# Altium schematic sheet Other Components.SchDoc: Other Components
size A3; SheetNumber: 1; SheetTotal: 1
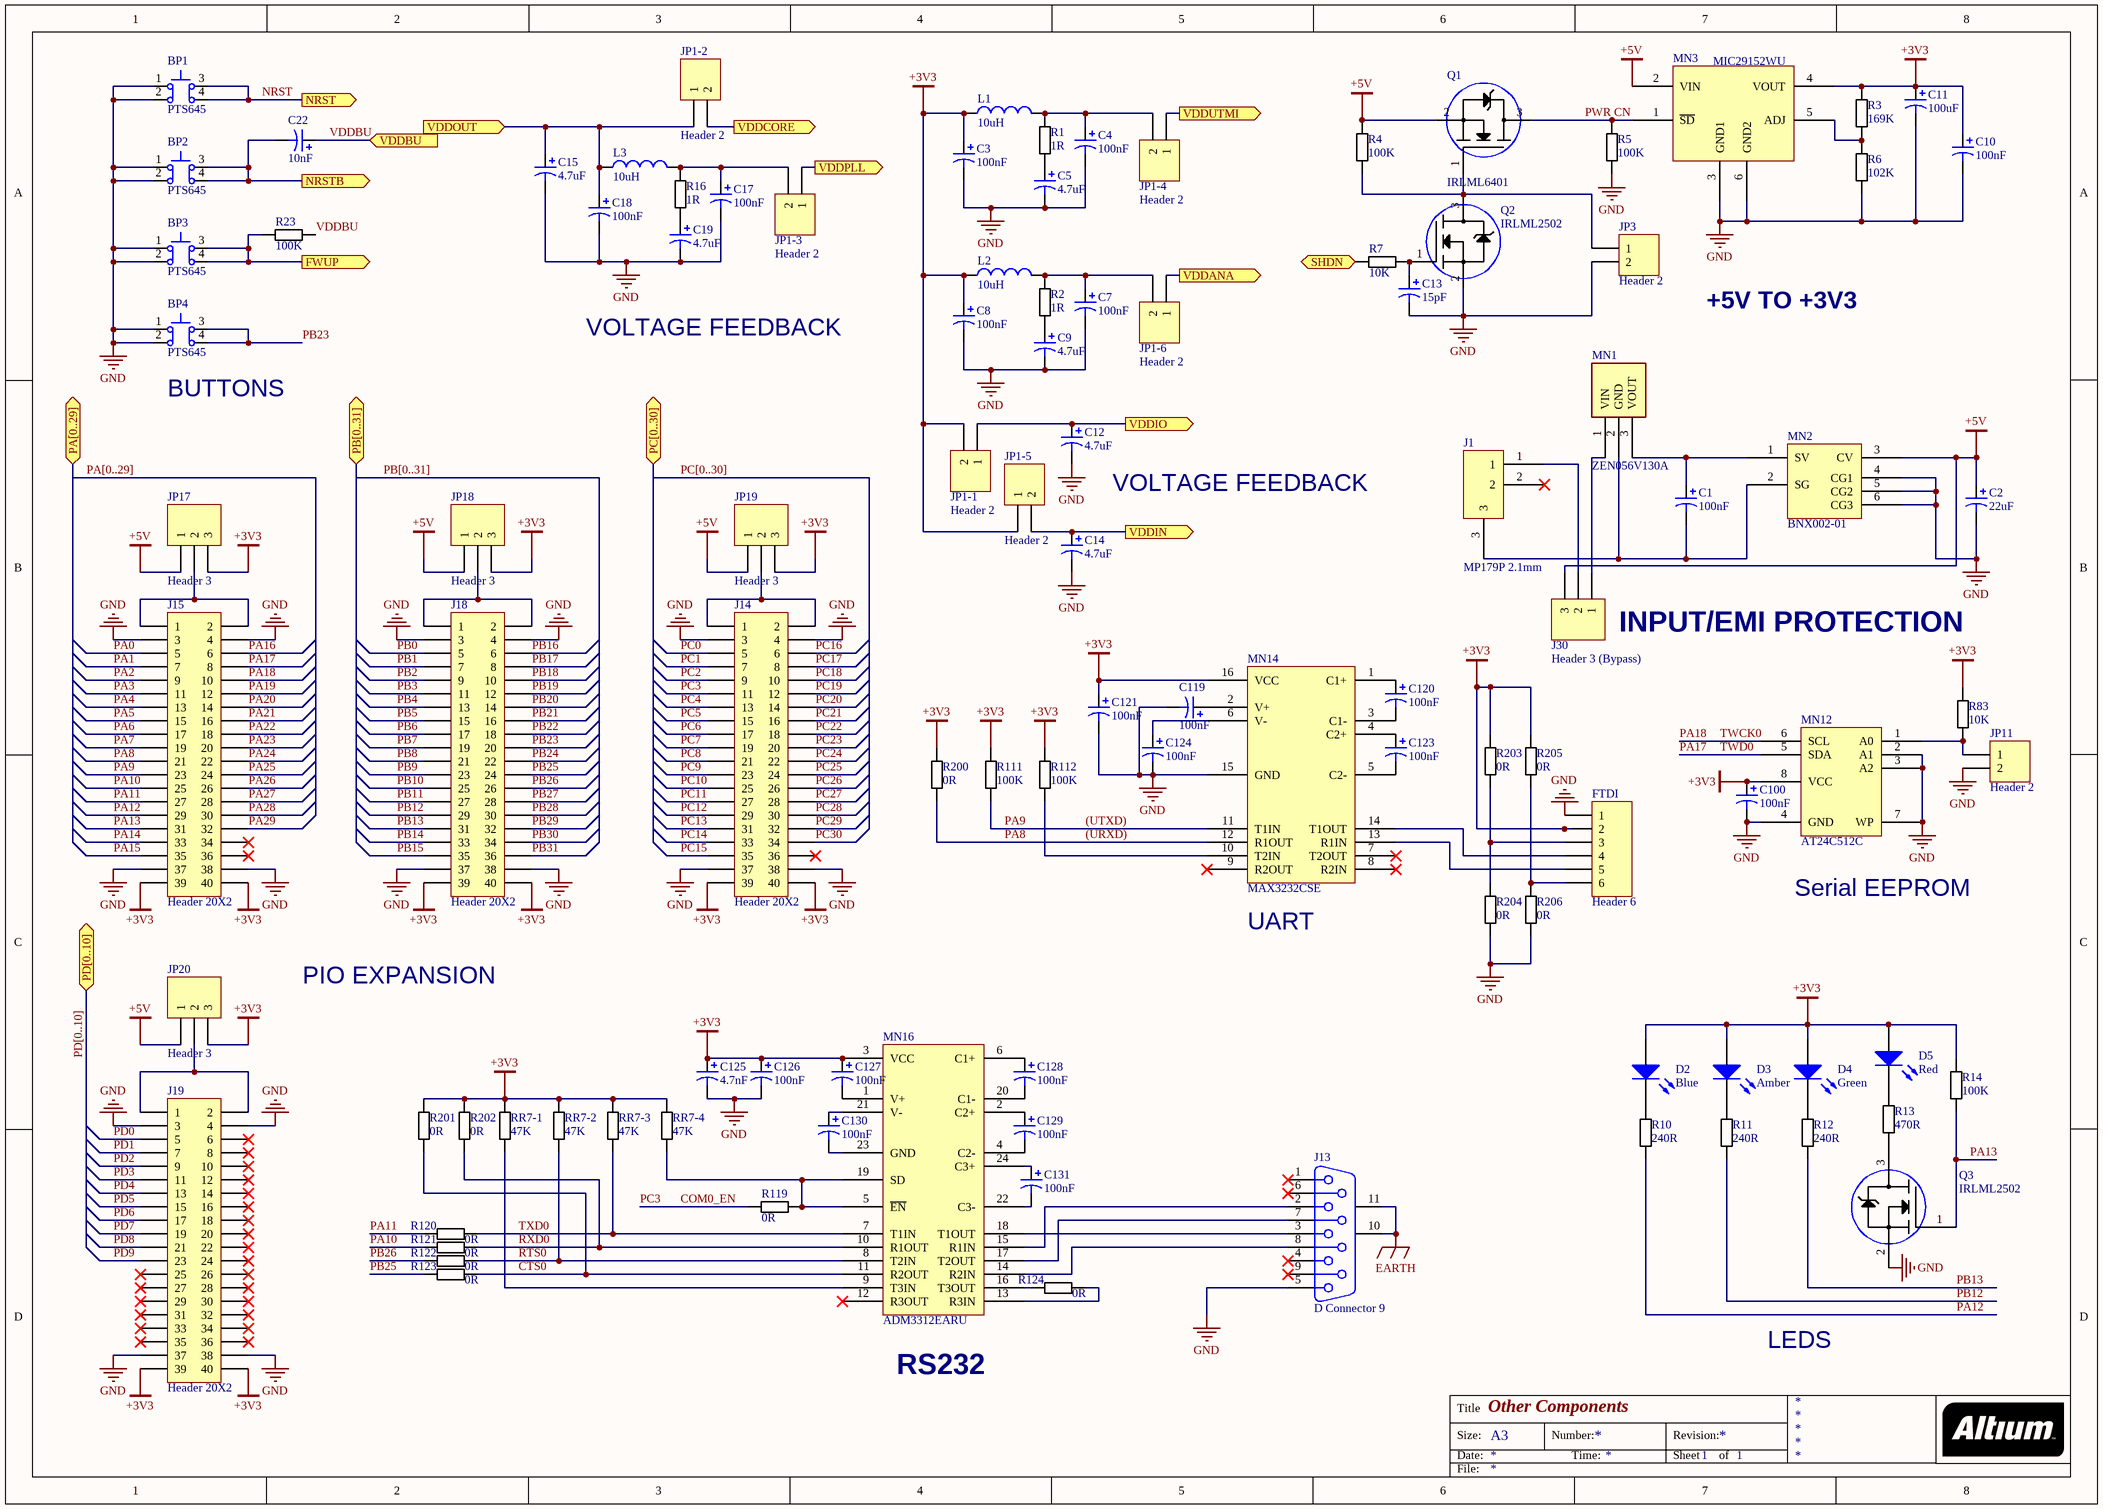
[diagram p0: Other Components.SchDoc]

## Parts
BP1  PTS645  [PTS645]
BP2  PTS645  [PTS645]
BP3  PTS645  [PTS645]
BP4  PTS645  [PTS645]
C1  value 100nF  [0805 Cap]  (hidden comment: Cap Pol3)
C2  value 22uF  [0805 Cap]  (hidden comment: Cap Pol3)
C3  value 100nF  [0805 Cap]  (hidden comment: Cap Pol3)
C4  value 100nF  [0805 Cap]  (hidden comment: Cap Pol3)
C5  value 4.7uF  [0805 Cap]  (hidden comment: Cap Pol3)
C7  value 100nF  [0805 Cap]  (hidden comment: Cap Pol3)
C8  value 100nF  [0805 Cap]  (hidden comment: Cap Pol3)
C9  value 4.7uF  [0805 Cap]  (hidden comment: Cap Pol3)
C10  value 100nF  [0805 Cap]  (hidden comment: Cap Pol3)
C11  value 100uF  [0805 Cap]  (hidden comment: Cap Pol3)
C12  value 4.7uF  [0805 Cap]  (hidden comment: Cap Pol3)
C13  value 15pF  [0805 Cap]  (hidden comment: Cap Pol3)
C14  value 4.7uF  [0805 Cap]  (hidden comment: Cap Pol3)
C15  value 4.7uF  [0805 Cap]  (hidden comment: Cap Pol3)
C17  value 100nF  [0805 Cap]  (hidden comment: Cap Pol3)
C18  value 100nF  [0805 Cap]  (hidden comment: Cap Pol3)
C19  value 4.7uF  [0805 Cap]  (hidden comment: Cap Pol3)
C22  value 10nF  [0805 Cap]  (hidden comment: Cap Pol3)
C100  value 100nF  [0805 Cap]  (hidden comment: Cap Pol3)
C119  value 100nF  [0805 Cap]  (hidden comment: Cap Pol3)
C120  value 100nF  [0805 Cap]  (hidden comment: Cap Pol3)
C121  value 100nF  [0805 Cap]  (hidden comment: Cap Pol3)
C123  value 100nF  [0805 Cap]  (hidden comment: Cap Pol3)
C124  value 100nF  [0805 Cap]  (hidden comment: Cap Pol3)
C125  value 4.7nF  [0805 Cap]  (hidden comment: Cap Pol3)
C126  value 100nF  [0805 Cap]  (hidden comment: Cap Pol3)
C127  value 100nF  [0805 Cap]  (hidden comment: Cap Pol3)
C128  value 100nF  [0805 Cap]  (hidden comment: Cap Pol3)
C129  value 100nF  [0805 Cap]  (hidden comment: Cap Pol3)
C130  value 100nF  [0805 Cap]  (hidden comment: Cap Pol3)
C131  value 100nF  [0805 Cap]  (hidden comment: Cap Pol3)
D2  Blue  [0805 LED]
D3  Amber  [0805 LED]
D4  Green  [0805 LED]
D5  Red  [0805 LED]
FTDI  Header 6  [HDR1X6]
J1  MP179P 2.1mm  [2.1mm Jack]
J13  D Connector 9  [DSUB1.385-2H9]
J14  Header 20X2  [HDR2X20]
J15  Header 20X2  [HDR2X20]
J18  Header 20X2  [HDR2X20]
J19  Header 20X2  [HDR2X20]
J30  Header 3 (Bypass)  [HDR1X3]
JP1-1  Header 2  [HDR1X2]
JP1-2  Header 2  [HDR1X2]
JP1-3  Header 2  [HDR1X2]
JP1-4  Header 2  [HDR1X2]
JP1-5  Header 2  [HDR1X2]
JP1-6  Header 2  [HDR1X2]
JP3  Header 2  [HDR1X2]
JP11  Header 2  [HDR1X2]
JP17  Header 3  [HDR1X3]
JP18  Header 3  [HDR1X3]
JP19  Header 3  [HDR1X3]
JP20  Header 3  [HDR1X3]
L1  value 10uH  [0805 Resistor]  (hidden comment: Inductor)
L2  value 10uH  [0805 Resistor]  (hidden comment: Inductor)
L3  value 10uH  [0805 Resistor]  (hidden comment: Inductor)
MN1  ZEN056V130A  [ZEN056V130A24L]
MN2  BNX002-01  [BNX002]
MN3  MIC29152WU  [MIC29152WU]
MN12  AT24C512C  [AT24C512C]
MN14  MAX3232CSE  [SOIC127P570X175-16N]
MN16  ADM3312EARU  [TSOP65P640X120-24N]
Q1  IRLML6401  [3 Pin SOT-23]
Q2  IRLML2502  [3 Pin SOT-23]
Q3  IRLML2502  [3 Pin SOT-23]
R1  value 1R  [0805 Resistor]  (hidden comment: 0805 Resistor)
R2  value 1R  [0805 Resistor]  (hidden comment: 0805 Resistor)
R3  value 169K  [0805 Resistor]  (hidden comment: 0805 Resistor)
R4  value 100K  [0805 Resistor]  (hidden comment: 0805 Resistor)
R5  value 100K  [0805 Resistor]  (hidden comment: 0805 Resistor)
R6  value 102K  [0805 Resistor]  (hidden comment: 0805 Resistor)
R7  value 10K  [0805 Resistor]  (hidden comment: 0805 Resistor)
R10  value 240R  [0805 Resistor]  (hidden comment: 0805 Resistor)
R11  value 240R  [0805 Resistor]  (hidden comment: 0805 Resistor)
R12  value 240R  [0805 Resistor]  (hidden comment: 0805 Resistor)
R13  value 470R  [0805 Resistor]  (hidden comment: 0805 Resistor)
R14  value 100K  [0805 Resistor]  (hidden comment: 0805 Resistor)
R16  value 1R  [0805 Resistor]  (hidden comment: 0805 Resistor)
R23  value 100K  [0805 Resistor]  (hidden comment: 0805 Resistor)
R83  value 10K  [0805 Resistor]  (hidden comment: 0805 Resistor)
R111  value 100K  [0805 Resistor]  (hidden comment: 0805 Resistor)
R112  value 100K  [0805 Resistor]  (hidden comment: 0805 Resistor)
R119  value 0R  [0805 Resistor]  (hidden comment: 0805 Resistor)
R120  value 0R  [0805 Resistor]  (hidden comment: 0805 Resistor)
R121  value 0R  [0805 Resistor]  (hidden comment: 0805 Resistor)
R122  value 0R  [0805 Resistor]  (hidden comment: 0805 Resistor)
R123  value 0R  [0805 Resistor]  (hidden comment: 0805 Resistor)
R124  value 0R  [0805 Resistor]  (hidden comment: 0805 Resistor)
R200  value 0R  [0805 Resistor]  (hidden comment: 0805 Resistor)
R201  value 0R  [0805 Resistor]  (hidden comment: 0805 Resistor)
R202  value 0R  [0805 Resistor]  (hidden comment: 0805 Resistor)
R203  value 0R  [0805 Resistor]  (hidden comment: 0805 Resistor)
R204  value 0R  [0805 Resistor]  (hidden comment: 0805 Resistor)
R205  value 0R  [0805 Resistor]  (hidden comment: 0805 Resistor)
R206  value 0R  [0805 Resistor]  (hidden comment: 0805 Resistor)
RR7-1  value 47K  [0805 Resistor]  (hidden comment: 0805 Resistor)
RR7-2  value 47K  [0805 Resistor]  (hidden comment: 0805 Resistor)
RR7-3  value 47K  [0805 Resistor]  (hidden comment: 0805 Resistor)
RR7-4  value 47K  [0805 Resistor]  (hidden comment: 0805 Resistor)

## Ports
FWUP (out), NRST (out), NRSTB (out), PA[0..29] (bidir), PB[0..31] (bidir), PC[0..30] (bidir), PD[0..10] (bidir), SHDN (in), VDDANA (out), VDDBU (in), VDDCORE (out), VDDIN (out), VDDIO (out), VDDOUT (in), VDDPLL (out), VDDUTMI (out)

## Nets
+3V3: C3.1 C8.1 C10.1 C11.1 C100.1 C121.1 C125.1 C126.1 C127.1 D2.1(A) D3.1(A) D4.1(A) D5.1(A) FTDI.2 J14.39 J14.40 J15.39 J15.40 J18.39 J18.40 J19.39 J19.40 JP1-1.2 JP1-5.1 JP17.3 JP18.3 JP19.3 JP20.3 L1.1 L2.1 MN3.4(VOUT) MN12.8(VCC) MN14.16(VCC) MN16.3(VCC) R3.2 R14.2 R83.2 R111.2 R112.2 R200.2 R201.2 R202.2 R203.2 R205.2 RR7-1.1 RR7-2.1 RR7-3.1 RR7-4.1
+5V: C2.1 J30.3 JP17.1 JP18.1 JP19.1 JP20.1 MN2.3(CV) MN3.2(VIN) Q1.2(S) R4.2
EARTH: J13.10(MH1) J13.11(MH2)
GND: BP1.1 BP1.2 BP2.1 BP2.2 BP3.1 BP3.2 BP4.1 BP4.2 C2.2 C3.2 C4.2 C5.2 C7.2 C8.2 C9.2 C10.2 C11.2 C12.2 C13.2 C14.2 C15.2 C17.2 C18.2 C19.2 C100.2 C119.2 C121.2 C124.2 C125.2 C126.2 FTDI.1 J13.5 J14.3 J14.4 J14.37 J14.38 J15.3 J15.4 J15.37 J15.38 J18.3 J18.4 J18.37 J18.38 J19.3 J19.4 J19.37 J19.38 JP3.2 JP11.2 MN2.4(CG1) MN2.5(CG2) MN2.6(CG3) MN3.3(GND1) MN3.6(GND2) MN12.2(A1) MN12.3(A2) MN12.4(GND) MN12.7(WP) MN14.15(GND) Q2.2(S) R5.1 R6.1 R204.1 R206.1
(URXD): J15.21 MN14.12(R1OUT) R200.1  [also labelled PA8]
(UTXD): J15.23 MN14.11(T1IN) R111.1  [also labelled PA9]
COM0_EN: J14.11 R119.1  [also labelled PC3]
CTS0: MN16.11(R2OUT) R123.2 R201.1
FWUP: BP3.3 BP3.4 R23.1 ; port FWUP
NRST: BP1.3 BP1.4 ; port NRST
NRSTB: BP2.3 BP2.4 C22.2 ; port NRSTB
PA0: J15.5
PA1: J15.7
PA2: J15.9
PA3: J15.11
PA4: J15.13
PA5: J15.15
PA6: J15.17
PA7: J15.19
PA10: J15.25 R121.1
PA11: J15.27 R120.1
PA12: J15.29 R10.1
PA13: J15.31 R14.1
PA14: J15.33
PA15: J15.35
PA16: J15.6
PA17: J15.8 MN12.5(SDA)  [also labelled TWD0]
PA18: J15.10 MN12.6(SCL)  [also labelled TWCK0]
PA19: J15.12
PA20: J15.14
PA21: J15.16
PA22: J15.18
PA23: J15.20
PA24: J15.22
PA25: J15.24
PA26: J15.26
PA27: J15.28
PA28: J15.30
PA29: J15.32
PB0: J18.5
PB1: J18.7
PB2: J18.9
PB3: J18.11
PB4: J18.13
PB5: J18.15
PB6: J18.17
PB7: J18.19
PB8: J18.21
PB9: J18.23
PB10: J18.25
PB11: J18.27
PB12: J18.29 R11.1
PB13: J18.31 R12.1
PB14: J18.33
PB15: J18.35
PB16: J18.6
PB17: J18.8
PB18: J18.10
PB19: J18.12
PB20: J18.14
PB21: J18.16
PB22: J18.18
PB23: BP4.3 BP4.4 J18.20
PB24: J18.22
PB25: J18.24 R123.1
PB26: J18.26 R122.1
PB27: J18.28
PB28: J18.30
PB29: J18.32
PB30: J18.34
PB31: J18.36
PC0: J14.5
PC1: J14.7
PC2: J14.9
PC4: J14.13
PC5: J14.15
PC6: J14.17
PC7: J14.19
PC8: J14.21
PC9: J14.23
PC10: J14.25
PC11: J14.27
PC12: J14.29
PC13: J14.31
PC14: J14.33
PC15: J14.35
PC16: J14.6
PC17: J14.8
PC18: J14.10
PC19: J14.12
PC20: J14.14
PC21: J14.16
PC22: J14.18
PC23: J14.20
PC24: J14.22
PC25: J14.24
PC26: J14.26
PC27: J14.28
PC28: J14.30
PC29: J14.32
PC30: J14.34
PD0: J19.5
PD1: J19.7
PD2: J19.9
PD3: J19.11
PD4: J19.13
PD5: J19.15
PD6: J19.17
PD7: J19.19
PD8: J19.21
PD9: J19.23
PWR CN: MN3.1(~{SD}) Q1.3(D) R5.2
RTS0: MN16.8(T2IN) R122.2 RR7-2.2
RXD0: MN16.10(R1OUT) R121.2 R202.1
SHDN: R7.2 ; port SHDN
TXD0: MN16.7(T1IN) R120.2 RR7-3.2
VDDANA: JP1-6.1 ; port VDDANA
VDDBU: C22.1 R23.2 ; port VDDBU
VDDCORE: JP1-2.2 ; port VDDCORE
VDDIN: C14.1 JP1-5.2 ; port VDDIN
VDDIO: C12.1 JP1-1.1 ; port VDDIO
VDDOUT: C15.1 C18.1 JP1-2.1 L3.1 ; port VDDOUT
VDDPLL: JP1-3.1 ; port VDDPLL
VDDUTMI: JP1-4.1 ; port VDDUTMI
NetC1_1: C1.1 MN1.3(VOUT) MN2.1(SV)
NetC1_2: C1.2 J1.3 MN1.2(GND) MN2.2(SG)
NetC4_1: C4.1 JP1-4.2 L1.2 R1.2
NetC5_1: C5.1 R1.1
NetC7_1: C7.1 JP1-6.2 L2.2 R2.2
NetC9_1: C9.1 R2.1
NetC13_1: C13.1 Q2.1(G) R7.1
NetC17_1: C17.1 JP1-3.2 L3.2 R16.2
NetC19_1: C19.1 R16.1
NetC119_1: C119.1 MN14.2(V+)
NetC120_1: C120.1 MN14.1(C1+)
NetC120_2: C120.2 MN14.3(C1-)
NetC123_1: C123.1 MN14.4(C2+)
NetC123_2: C123.2 MN14.5(C2-)
NetC124_1: C124.1 MN14.6(V-)
NetC127_2: C127.2 MN16.1(V+)
NetC128_1: C128.1 MN16.6(C1+)
NetC128_2: C128.2 MN16.20(C1-)
NetC129_1: C129.1 MN16.2(C2+)
NetC129_2: C129.2 MN16.4(C2-)
NetC130_1: C130.1 MN16.21(V-)
NetC130_2: C130.2 MN16.23(GND)
NetC131_1: C131.1 MN16.24(C3+)
NetC131_2: C131.2 MN16.22(C3-)
NetD2_2: D2.2(K) R10.2
NetD3_2: D3.2(K) R11.2
NetD4_2: D4.2(K) R12.2
NetD5_2: D5.2(K) R13.2
NetFTDI_3: FTDI.3 R203.1 R204.2
NetFTDI_4: FTDI.4 MN14.14(T1OUT)
NetFTDI_5: FTDI.5 MN14.13(R1IN)
NetFTDI_6: FTDI.6 R205.1 R206.2
NetJ1_1: J1.1 J30.2
NetJ13_2: J13.2 MN16.15(R1IN)
NetJ13_3: J13.3 MN16.18(T1OUT)
NetJ13_7: J13.7 MN16.17(T2OUT)
NetJ13_8: J13.8 MN16.14(R2IN)
NetJ14_1: J14.1 J14.2 JP19.2
NetJ15_1: J15.1 J15.2 JP17.2
NetJ18_1: J18.1 J18.2 JP18.2
NetJ19_1: J19.1 J19.2 JP20.2
NetJ30_1: J30.1 MN1.1(VIN)
NetJP3_1: JP3.1 Q1.1(G) Q2.3(D) R4.1
NetJP11_1: JP11.1 MN12.1(A0) R83.1
NetMN3_5: MN3.5(ADJ) R3.1 R6.2
NetMN14_10: MN14.10(T2IN) R112.1
NetMN16_5: MN16.5(~{EN}) MN16.19(SD) R119.2 RR7-4.2
NetMN16_9: MN16.9(T3IN) RR7-1.2
NetMN16_13: MN16.13(R3IN) R124.2
NetMN16_16: MN16.16(T3OUT) R124.1

Not connected (* = marked no-connect by the designer): J1 2*; J13 1* 4* 6* 9*; J14 36*; J15 34* 36*; J19 6* 8* 10* 12* 14* 16* 18* 20* 22* 24* 25* 26* 27* 28* 29* 30* 31* 32* 33* 34* 35* 36*; MN14 7(T2OUT)* 8(R2IN)* 9(R2OUT)*; MN16 12(R3OUT)*; Q3 1 2 3; R13 1

## Buses and harness runs
bus PA[0..29] = port PA[0..29]
bus PB[0..31] = port PB[0..31]
bus PC[0..30] = port PC[0..30]
bus PD[0..10] = port PD[0..10]

## Notes on the sheet
- +5V TO +3V3
- VOLTAGE FEEDBACK
- (near BP4) BUTTONS
- (near J30) INPUT/EMI PROTECTION
- Serial EEPROM
- PIO EXPANSION
- (near MN14) UART
- (near MN16) RS232
- LEDS
- Labels drawn without touching a wire or pin: GND
- Title
- Size:
- Date:
- A3
- Number:
- Time:
- Revision:
- Sheet
- of
- File:

## Library data of the parts
BP1-BP4 = PTS645: Digi-Key Part Number CKN9112CT-ND; PackageDocument: Rev.0; Published: 6-Jun-2005; DatasheetDocument: Rev.0; PackageReference: IT-2175; Publisher: Altium Limited; ComponentLink1Description: Manufacturer Link; ComponentLink1URL: http://www.ilswitch.com/; ComponentLink2Description: Device Overview; ComponentLink2URL: http://www.ilswitch.com/list.php?ac_id=010112&ai_id=91
C1 C3-C5 C7-C15 C17-C19 C22 C100 C119-C121 C123-C131 = Cap Pol3: Polarized Capacitor (Surface Mount); Published: 8-Jun-2000; LatestRevisionDate: 29-May-2009; LatestRevisionNote: IPC-7351 Footprint Added.; PackageReference: C0805; Publisher: Altium Limited; PackageDescription: Chip Capacitor
C2 = Cap Pol3: Not sure if this one should be 0805?; Published: 8-Jun-2000; LatestRevisionDate: 29-May-2009; LatestRevisionNote: IPC-7351 Footprint Added.; PackageReference: C0805; Publisher: Altium Limited; PackageDescription: Chip Capacitor
D2 = LED2: Typical RED, GREEN, YELLOW, AMBER GaAs LED NO IDEA WHAT IS GOING ON WITH THE FOOTRPINTS; Published: 8-Jun-2000; LatestRevisionDate: 17-Jul-2002; LatestRevisionNote: Re-released for DXP Platform.; PackageVersion: Feb-2002; PackageReference: 3.2X1.6X1.1; Publisher: Altium Limited; PackageDescription: SM LED; 2 Flat Leads
D3 = LED2: Typical RED, GREEN, YELLOW, AMBER GaAs LED. NO IDEA WHAT IS GOING ON WITH THE FOOTPRINTS; Published: 8-Jun-2000; LatestRevisionDate: 17-Jul-2002; LatestRevisionNote: Re-released for DXP Platform.; PackageVersion: Feb-2002; PackageReference: 3.2X1.6X1.1; Publisher: Altium Limited; PackageDescription: SM LED; 2 Flat Leads
D4 = LED2: So I downloaded the footrpint off the net, but it seems to be dodgy, but for some reason the dims don't make sense; Published: 8-Jun-2000; LatestRevisionDate: 17-Jul-2002; LatestRevisionNote: Re-released for DXP Platform.; PackageVersion: Feb-2002; PackageReference: 3.2X1.6X1.1; Publisher: Altium Limited; PackageDescription: SM LED; 2 Flat Leads
D5 = LED2: Typical RED, GREEN, YELLOW, AMBER GaAs LED; Published: 8-Jun-2000; LatestRevisionDate: 17-Jul-2002; LatestRevisionNote: Re-released for DXP Platform.; PackageVersion: Feb-2002; PackageReference: 3.2X1.6X1.1; Publisher: Altium Limited; PackageDescription: SM LED; 2 Flat Leads
FTDI = Header 6: Header, 6-Pin; LatestRevisionDate: 17-Jul-2002; LatestRevisionNote: Re-released for DXP Platform.; Publisher: Altium Limited
J1 = MP179P 2.1mm: Digi-Key Part Number CP-002AHPJCT-ND
J13 = D Connector 9: Receptacle Assembly, 9 Position, Right Angle; Supplier: Digikey
J14 J15 J18 J19 = Header 20X2: Header, 20-Pin, Dual row; LatestRevisionDate: 17-Jul-2002; LatestRevisionNote: Re-released for DXP Platform.; Publisher: Altium Limited
J30 JP17-JP20 = Header 3: Header, 3-Pin; LatestRevisionDate: 17-Jul-2002; LatestRevisionNote: Re-released for DXP Platform.; Publisher: Altium Limited
JP1-1-JP1-6 JP3 JP11 = Header 2: Header, 2-Pin; Manufacturer: Molex; Supplier: Digikey; Supplier P/N: WM6440-ND; Manufacturer P/N: 22-28-4025
L1-L3 = Inductor: DigiKey: 587-1691-1-ND; Code_IEC: 1005; Published: 8-Jun-2000; LatestRevisionDate: 29-May-2009; LatestRevisionNote: IPC-7351 Footprint Added.; PackageReference: 0402-A; Publisher: Altium Limited; PackageDescription: Chip Inductor; Code_JEITA: 0402
MN1 = ZEN0656V130A: Digi-key number: ZEN056V130A24LSCT-ND
MN2 = BNX002-01: Digikey number: 490-5053-ND
MN3 = MIC29152WU: Mircel's 1.5A LDO TO263-5. Digikey Number: 576-3367-5-ND
MN12 = AT24C512C: Digikey Number: AT24C512C-SSHD-TCT-ND
MN14 = MAX3232CSE: Digikey Number: MAX3232CSE+-ND
MN16 = ADM3312EARU: Digikey Number: ADM3312EARUZ-ND
Q1 = IRLML6401: Digikey Part Number: IRLML6401PBFCT-ND
Q2 Q3 = IRLML2502: DigiKey Part no: IRLML2502PBFCT-ND
R1-R7 R10-R14 R16 R23 R83 R119 R200-R206 = 0805 Thick Film Resistor 1%
R111 R112 R120-R124 RR7-1-RR7-4 = 0805 Thick Film Resistor 1%_1: 0805 Thick Film Resistor 1%